# Altium schematic sheet Electrical.SchDoc
size A4
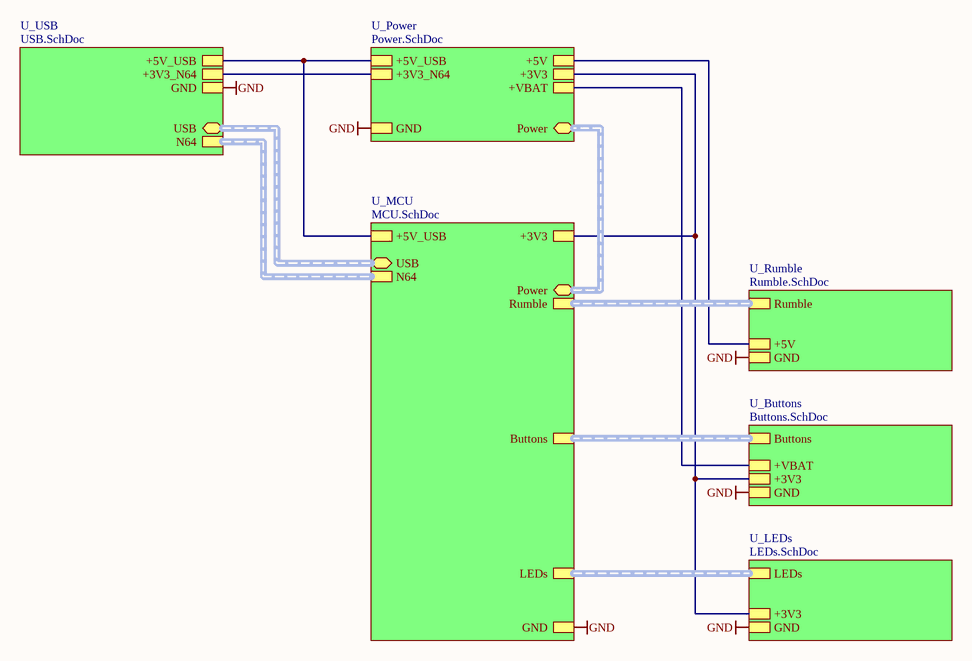
[diagram p0: Electrical.SchDoc]

## Sub-sheets
U_Buttons = Buttons.SchDoc: Buttons (harness Buttons), GND, +3V3, +VBAT
U_LEDs = LEDs.SchDoc: LEDs (harness LEDs), +3V3, GND
U_MCU = MCU.SchDoc: Buttons (harness Buttons), LEDs (harness LEDs), Rumble (harness Rumble), +3V3, +5V_USB, GND, N64 (harness N64), Power (harness Power), USB (harness USB)
U_Power = Power.SchDoc: +5V_USB, +3V3_N64, GND, +5V, +3V3, +VBAT, Power (harness Power)
U_Rumble = Rumble.SchDoc: GND, +5V, Rumble (harness Rumble)
U_USB = USB.SchDoc: +5V_USB, GND, N64 (harness N64), +3V3_N64, USB (harness USB)

## Nets
GND: sheet U_MCU/GND, sheet U_LEDs/GND, sheet U_Rumble/GND, sheet U_Power/GND, sheet U_Buttons/GND, sheet U_USB/GND
(unnamed): sheet U_MCU/+3V3, sheet U_LEDs/+3V3, sheet U_Power/+3V3, sheet U_Buttons/+3V3
(unnamed): sheet U_MCU/+5V_USB, sheet U_Power/+5V_USB, sheet U_USB/+5V_USB
(unnamed): sheet U_Rumble/+5V, sheet U_Power/+5V
(unnamed): sheet U_Power/+3V3_N64, sheet U_USB/+3V3_N64
(unnamed): sheet U_Power/+VBAT, sheet U_Buttons/+VBAT

## Buses and harness runs
harness sheet U_Buttons/Buttons = sheet U_MCU/Buttons
harness sheet U_LEDs/LEDs = sheet U_MCU/LEDs
harness sheet U_MCU/N64 = sheet U_USB/N64
harness sheet U_MCU/Power = sheet U_Power/Power
harness sheet U_MCU/Rumble = sheet U_Rumble/Rumble
harness sheet U_MCU/USB = sheet U_USB/USB

## Notes on the sheet
- Title
- Size:
- Date:
- A4
- Number:
- Time:
- Revision:
- Sheet
- of
- File: